# Altium schematic sheet PowerSupply.SchDoc
size A4
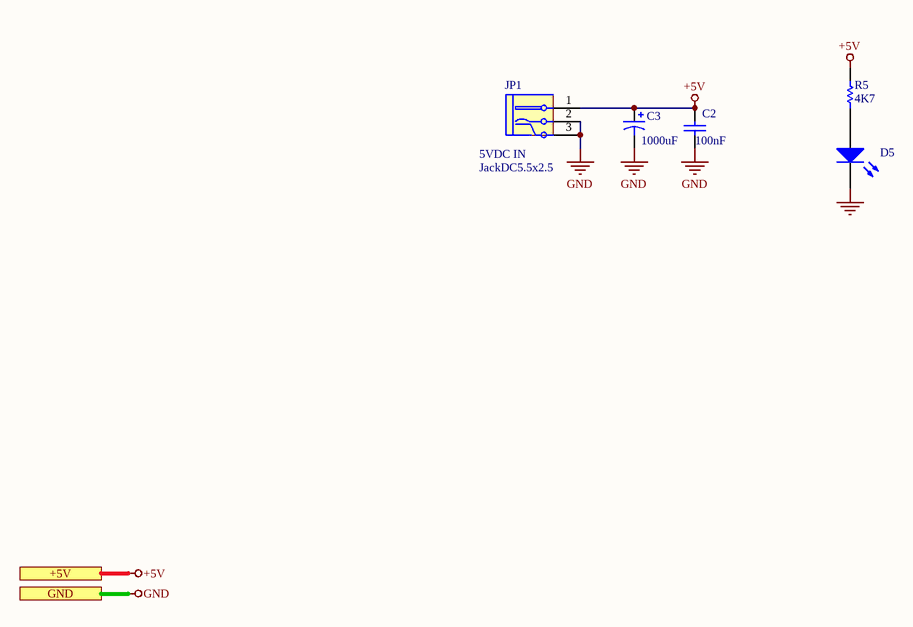
[diagram p0: PowerSupply.SchDoc]

## Parts
C2  value 100nF  [C-0805]  (hidden comment: 104)
C3  value 1000uF  [RB7.6-15]  (hidden comment: 1000uF/16V)
D5  SMD0805-RED  [LED-0805]  (value not drawn)
JP1  JackDC5.5x2.5  value 5VDC IN
R5  4K7  [R-0805]

## Ports
+5V, GND

## Nets
+5V: C2.1 C3.1 JP1.1(T) R5.2 ; port +5V
GND: C2.2 C3.2 D5.2(K) JP1.2(TN) JP1.3(S) ; port GND
NetD5_1: D5.1(A) R5.1

## Library data of the parts
C2 = Cap: Capacitor; Published: 8-Jun-2000; LatestRevisionDate: 17-Jul-2002; LatestRevisionNote: Re-released for DXP Platform.; PackageReference: RAD-0.3; Publisher: Altium Limited
C3 = Cap Pol1: Polarized Capacitor (Radial); Published: 8-Jun-2000; LatestRevisionDate: 17-Jul-2002; LatestRevisionNote: Re-released for DXP Platform.; PackageReference: RB7.6-15; Publisher: Altium Limited; PackageDescription: Polarized Capacitor (Radial); 2 Leads
D5 = LED0: Typical INFRARED GaAs LED; Value: PowerLed; Published: 8-Jun-2000; LatestRevisionDate: 08-Jul-2005; LatestRevisionNote: Mech Layer 1 removed.; PackageReference: LED-0
JP1 = JACK DC5.5x2.5: Jack DC5.5x2.5MM DC5525
R5 = Res1: Resistor; Published: 8-Jun-2000; LatestRevisionDate: 17-Jul-2002; LatestRevisionNote: Re-released for DXP Platform.; PackageReference: AXIAL-0.3; Publisher: Altium Limited; PackageDescription: Axial Device, Thru-Hole; 2 Leads; 0.3 in Pin Spacing; Value: 4K7